# EAGLE schematic logic-connector (EAGLE 7.2.0)
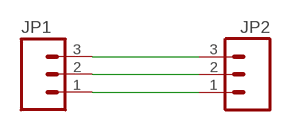
[diagram p0: schematic, sheet 1]

## Parts
JP1  M031X03_NO_SILK  [1X03_NO_SILK]
JP2  M031X03_NO_SILK  [1X03_NO_SILK]

## Nets
N$1: JP1.3 JP2.3
N$2: JP1.2 JP2.2
N$3: JP1.1 JP2.1

## Library data of the parts
JP1 JP2 = SparkFun-Connectors:M03: Header 3 Standard 3-pin 0.1" header. Use with straight break away headers (SKU : PRT-00116), right angle break away headers (PRT-00553), swiss pins (PRT-00743), machine pins (PRT-00117), and female headers (PRT-00115). Molex polarized connector foot print use with SKU : PRT-08232 with associated crimp pins and housings.